# Altium schematic sheet SchematicLNA.SchDoc
size A4; SheetNumber: 1; SheetTotal: 1
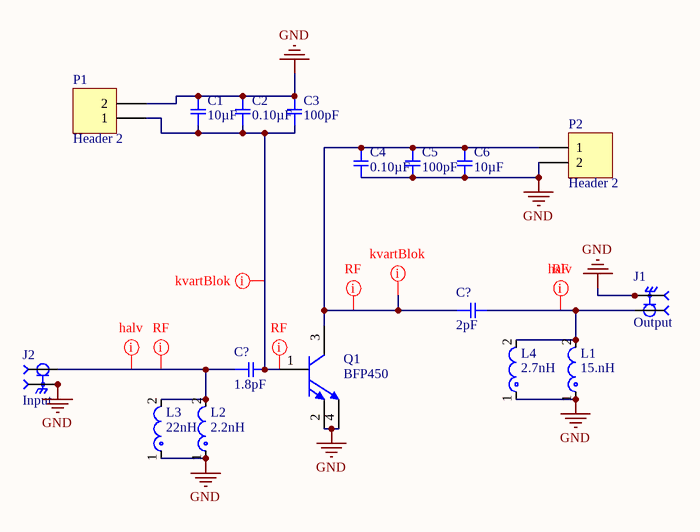
[diagram p0: SchematicLNA.SchDoc]

## Parts
(Parts that share a designator on the sheet are numbered #1, #2 ... from top to bottom, then left to right.)
C1  10µF  [SMD-0603C]
C2  0.10µF  [SMD-0603C]
C3  100pF  [SMD-0603C]
C4  0.10µF  [SMD-0603C]
C5  100pF  [SMD-0603C]
C6  10µF  [SMD-0603C]
C?#1  2pF  [SMD-0402C]
C?#2  1.8pF  [SMD-0402C]
J1  Output  [LPRS_SMACONNECTOR]
J2  Input  [LPRS_SMACONNECTOR]
L1  15.nH  [FP-LQG18HH_00-MFG]
L2  2.2nH  [FP-LQG18HH_00-MFG]
L3  22nH  [FP-LQG18HH_00-MFG]
L4  2.7nH  [FP-LQG18HH_00-MFG]
P1  Header 2  [HDR1X2]
P2  Header 2  [HDR1X2]
Q1  BFP450  [INF-SOT343_V]

## Nets
GND: C1.1 C2.1 C3.1 C4.2 C5.2 C6.2 J1.2 J1.3 J1.4 J1.5 J2.2 J2.3 J2.4 J2.5 L1.1 L2.1 L3.1 L4.1 P1.2 P2.2 Q1.2(E) Q1.4(E)
NetC1_2: C1.2 C2.2 C3.2 C?#2.2 P1.1 Q1.1(B)
NetC4_1: C4.1 C5.1 C6.1 C?#1.1 P2.1 Q1.3(C)
NetC?#1_2: C?#1.2 J1.1 L1.2 L4.2
NetC?#2_1: C?#2.1 J2.1 L2.2 L3.2

## Layout directives
net class RF: NetC1_2, NetC4_1, NetC?#1_2, NetC?#2_1
rule Length Constraint [Min Length = 15.8mm    Max Length = 16.4mm]: NetC1_2, NetC4_1
rule Length Constraint [Min Length = 31.6mm    Max Length = 32.7mm]: NetC?#1_2, NetC?#2_1

## Library data of the parts
C1 C6 = GRM185R60J106ME15D: CAP CER 10UF 6.3V X5R 0603; Manufacturer: Murata Electronics North America; Factory Stock: 0; Unit Price (USD): 0.36; Minimum Quantity: 1; Tolerance: ±20%; Datasheets: http://www.murata.com/~/media/webrenewal/support/library/catalog/products/capacitor/mlcc/c02e.pdf; Image: //media.digikey.com/Renders/Murata%20Renders/ZRB-SERIES-0402.jpg; Digi-Key Part Number: 490-10467-1-ND; Part Number: GRM185R60J106ME15D; Quantity Available: 25068; @ qty: 0; Packaging: Cut Tape (CT); Series: GRM; Part Status: Active; Value: 10µF; Voltage: 6.3V; Temperature Coefficient: X5R; Operating Temperature: -55°C ~ 85°C; Features: Derating Recommended; Ratings: -; Applications: General Purpose; Mounting Type: Surface Mount, MLCC; Package / Case: 0603 (1608 Metric); Size / Dimension: 0.063" L x 0.031" W (1.60mm x 0.80mm); Height - Seated (Max): -; Thickness (Max): 0.022" (0.55mm); Lead Spacing: -; Lead Style: -
C2 C4 = GCJ188R71C104KA01D: CAP CER 0.1UF 16V X7R 0603; Manufacturer: Murata Electronics North America; Factory Stock: 0; Unit Price (USD): 0.21; Minimum Quantity: 1; Tolerance: ±10%; Datasheets: http://www.murata.com/~/media/webrenewal/support/library/catalog/products/capacitor/mlcc/c03e.ashx; Image: //media.digikey.com/Renders/Murata%20Renders/0603%28LQG18%29.jpg; Digi-Key Part Number: 490-5796-1-ND; Part Number: GCJ188R71C104KA01D; Quantity Available: 22473; @ qty: 0; Packaging: Cut Tape (CT); Series: GCJ; Part Status: Active; Value: 0.10µF; Voltage: 16V; Temperature Coefficient: X7R; Operating Temperature: -55°C ~ 125°C; Features: Soft Termination; Ratings: AEC-Q200; Applications: Automotive, Boardflex Sensitive; Mounting Type: Surface Mount, MLCC; Package / Case: 0603 (1608 Metric); Size / Dimension: 0.063" L x 0.031" W (1.60mm x 0.80mm); Height - Seated (Max): -; Thickness (Max): 0.035" (0.90mm); Lead Spacing: -; Lead Style: -
C3 C5 = GCM1885C1H101JA16D: CAP CER 100PF 50V NP0 0603; Manufacturer: Murata Electronics North America; Factory Stock: 0; Unit Price (USD): 0.1; Minimum Quantity: 1; Tolerance: ±5%; Temperature Coefficient: C0G, NP0; Datasheets: http://www.murata.com/~/media/webrenewal/support/library/catalog/products/capacitor/mlcc/c03e.ashx; Image: //media.digikey.com/Renders/Murata%20Renders/0603%28GCM188%29.jpg; Digi-Key Part Number: 490-4767-1-ND; Part Number: GCM1885C1H101JA16D; Quantity Available: 85695; @ qty: 0; Packaging: Cut Tape (CT); Series: GCM; Part Status: Active; Value: 100pF; Voltage: 50V; Operating Temperature: -55°C ~ 125°C; Features: -; Ratings: AEC-Q200; Applications: Automotive; Mounting Type: Surface Mount, MLCC; Package / Case: 0603 (1608 Metric); Size / Dimension: 0.063" L x 0.031" W (1.60mm x 0.80mm); Height - Seated (Max): -; Thickness (Max): 0.035" (0.90mm); Lead Spacing: -; Lead Style: -
C?#1 = GJM1555C1H2R0CB01D: CAP CER 2PF 50V NP0 0402; Manufacturer: Murata Electronics North America; Factory Stock: 0; Unit Price (USD): 0.1; Minimum Quantity: 1; Tolerance: ±0.25pF; Temperature Coefficient: C0G, NP0; Datasheets: http://www.murata.com/~/media/webrenewal/support/library/catalog/products/capacitor/mlcc/c02e.pdf; Image: //media.digikey.com/Renders/Murata%20Renders/ZRB-SERIES-0402.jpg; Digi-Key Part Number: 490-3090-1-ND; Part Number: GJM1555C1H2R0CB01D; Quantity Available: 116263; @ qty: 0; Packaging: Cut Tape (CT); Series: GJM; Part Status: Active; Value: 2pF; Voltage: 50V; Operating Temperature: -55°C ~ 125°C; Features: High Q, Low Loss; Ratings: -; Applications: RF, Microwave, High Frequency; Mounting Type: Surface Mount, MLCC; Package / Case: 0402 (1005 Metric); Size / Dimension: 0.039" L x 0.020" W (1.00mm x 0.50mm); Height - Seated (Max): -; Thickness (Max): 0.022" (0.55mm); Lead Spacing: -; Lead Style: -
C?#2 = GJM1555C1H1R8BB01D: CAP CER 1.8PF 50V NP0 0402; Manufacturer: Murata Electronics North America; Factory Stock: 0; Unit Price (USD): 0.2; Minimum Quantity: 1; Tolerance: ±0.1pF; Temperature Coefficient: C0G, NP0; Datasheets: http://www.murata.com/~/media/webrenewal/support/library/catalog/products/capacitor/mlcc/c02e.pdf; Image: //media.digikey.com/Renders/Murata%20Renders/ZRB-SERIES-0402.jpg; Digi-Key Part Number: 490-8089-1-ND; Part Number: GJM1555C1H1R8BB01D; Quantity Available: 84355; @ qty: 0; Packaging: Cut Tape (CT); Series: GJM; Part Status: Active; Value: 1.8pF; Voltage: 50V; Operating Temperature: -55°C ~ 125°C; Features: High Q, Low Loss; Ratings: -; Applications: RF, Microwave, High Frequency; Mounting Type: Surface Mount, MLCC; Package / Case: 0402 (1005 Metric); Size / Dimension: 0.039" L x 0.020" W (1.00mm x 0.50mm); Height - Seated (Max): -; Thickness (Max): 0.022" (0.55mm); Lead Spacing: -; Lead Style: -
J1 J2 = SMACONNECTOR: SMA female RF coaxial connector for SMA male RF antennas.; Package: None; Price: None; Value: *; MP: SMACONNECTOR; Availability: Unavailable
L1 L4 = CMP-06042-009861-1: Multilayer type RF Inductor 3.3nH ±0.3nH 0.12Ω 1000mA 0603; Max DC Current: 500mA; Q Factor: 12; DC Resistance (DCR): 150mR; Test Frequency: 100MHz; Self Resonant Frequency: 6GHz; Shielding: Unshielded; Core Material: Air; Case/Package: 0603; DC Current: 500mA; Case Code (Metric): 1608; Package Quantity: 4000; Depth: 0.95mm; Max Operating Temperature: 85°C; Height - Seated (Max): 0.037inch; Mount: Surface Mount; REACH SVHC: No SVHC; Length: 1.6mm; Min Operating Temperature: -55°C; Military Standard: Not; Lead Free: Lead Free; Width: 0.8mm; Packaging: Tape and Reel; Height: 0.8mm; Termination: SMD/SMT; Current Rating: 500mA; Case Code (Imperial): 0603; Inductance: 3.3nH; Radiation Hardening: No
L2 L3 = CMP-06042-016493-1: Multilayer type RF Inductor 1.8nH ±0.3nH 0.1Ω 1100mA 0603; Core Material: Air; Test Frequency: 100MHz; Shielding: Unshielded; Max DC Current: 500mA; DC Resistance (DCR): 100mR; Q Factor: 12; Self Resonant Frequency: 6GHz; Height - Seated (Max): 0.037inch; Series: LQG18H; Termination: SMD/SMT; Height: 0.8mm; Length: 1.6mm; Number of Pins: 2; Max Operating Temperature: 85°C; Case Code (Imperial): 0603; Military Standard: Not; Case Code (Metric): 1608; Radiation Hardening: No; REACH SVHC: No SVHC; Package Quantity: 4000; Packaging: Tape and Reel; Mount: Surface Mount; Lead Free: Lead Free; Case/Package: 0603; RoHS Compliant: Yes; Min Operating Temperature: -55°C; DC Current: 500mA; Current Rating: 500mA; Depth: 0.95mm; Rated Current-Max: 500mA; Inductance: 1.8nH; Width: 0.8mm
P1 P2 = Header 2: Header, 2-Pin; LatestRevisionDate: 17-Jul-2002; LatestRevisionNote: Re-released for DXP Platform.; Publisher: Altium Limited
Q1 = CMP-1189-00011-1: High Linearity Low Noise Si NPN RF Transistor, 4.5 V VCEO, 100 mA IC, 15.5 dB Gmax, SOT343, Green; Manufacturer: Infineon; Green: yes; Ptot (max): 450.0 mW; VCEO (max): 4.5 V; Group: Si transistors with high gain up to 2.5 GHz; NFmin (typ): 1.25 dB; Gmax (typ): 15.5 dB; IC (max): 100 mA; ComponentLink1URL: http://www.infineon.com/; ComponentLink2URL: http://www.infineon.com/dgdl/bfp450.pdf?folderId=db3a30431400ef68011425b291f205c5&fileId=db3a30431400ef680114275d537d074b&location=en.Products.RF.RF_Transistors_.High_Linearity_Si-_and_SiGe_C-Transistors_for_use_up_to_6_GHz.DATASHEET.bfp450.pdf; ComponentLink3URL: http://www.infineon.com/dgdl/SOT343-Package_Overview.pdf?folderId=db3a30431936bc4b0119535155343cba&fileId=db3a30431936bc4b0119535a9f393cd3; Halogen-free: yes; DatasheetVersion: Rev. 1.0; ComponentLink3Description: Package Specification; PartNumber: BFP450; PackageReference: SOT343; ComponentLink1Description: Manufacturer URL; Mounting Technology: Surface Mount; ComponentLink2Description: Datasheet; PackageDescription: 4-Pin Small Outline Transistor Package, 1.25 x 2 mm Body